# Altium project Soldier.PrjPcb (part 2 of 2)

## Sheet soldier_TIA.SchDoc
size Tabloid; SheetNumber: 3; SheetTotal: 6
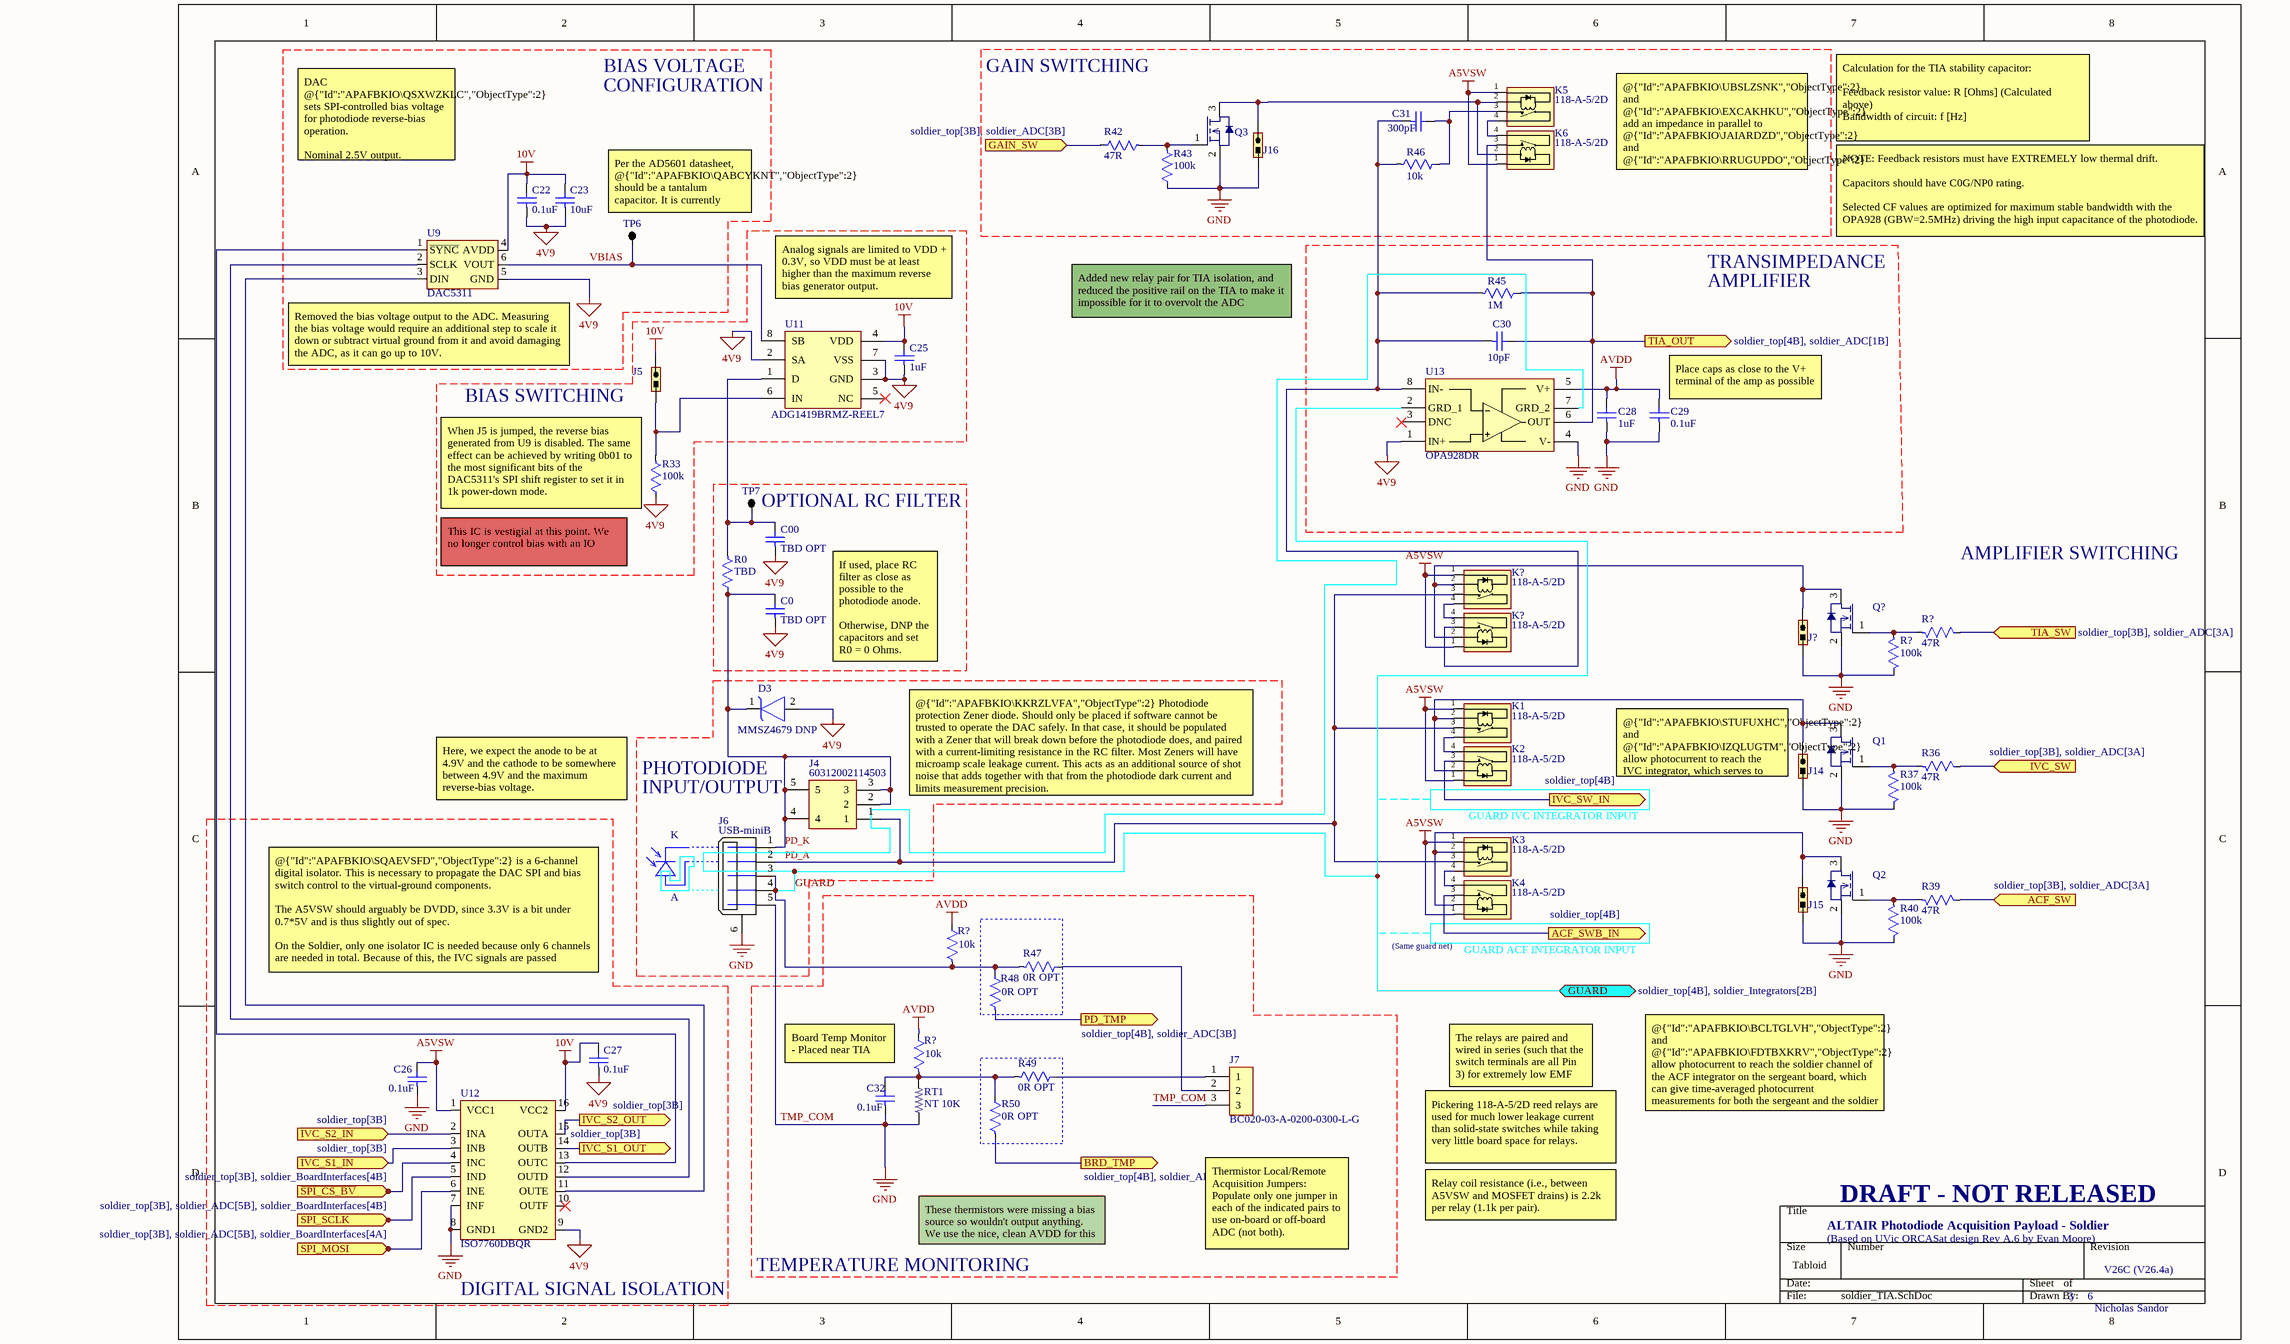
[diagram p3: soldier_TIA.SchDoc]

### Parts
C00  TBD OPT  [CAP 0603 IPC MID DENSITY]
C0  TBD OPT  [CAP 0603 IPC MID DENSITY]
C22  0.1uF  [CAP 0603 IPC MID DENSITY]
C23  10uF  [CAP 1206 IPC LOW DENSITY]
C25  1uF  [CAP 0603 IPC MID DENSITY]
C26  0.1uF  [CAP 0603 IPC MID DENSITY]
C27  0.1uF  [CAP 0603 IPC MID DENSITY]
C28  1uF  [CAP 0603 IPC MID DENSITY]
C29  0.1uF  [CAP 0603 IPC MID DENSITY]
C30  10pF  [CAP 1206 UNKNOWN]
C31  300pF  [CAP 1206 NON-IPC KEMET NP0]
C32  0.1uF  [CAP 0603 IPC MID DENSITY]
D3  MMSZ4679 DNP  [SOD-123 ONSEMI SMALL PADS]
J4  60312002114503  [COAX SMA THT]
J5  Jumper  [JUMPER 2POS 2.54MM PITCH THT]  (value not drawn)
J6  USB-miniB  [USB-miniB]
J7  BC020-03-A-0200-0300-L-G  [JUMPER 3POS 1MM PITCH THT]
J14  Jumper  [JUMPER 2POS 2.54MM PITCH THT]  (value not drawn)
J15  Jumper  [JUMPER 2POS 2.54MM PITCH THT]  (value not drawn)
J16  Jumper  [JUMPER 2POS 2.54MM PITCH THT]  (value not drawn)
J19  Jumper  [JUMPER 2POS 2.54MM PITCH THT]  (value not drawn)
K1  118-A-5/2D  [118-A-5/2D]
K2  118-A-5/2D  [118-A-5/2D]
K3  118-A-5/2D  [118-A-5/2D]
K4  118-A-5/2D  [118-A-5/2D]
K5  118-A-5/2D  [118-A-5/2D]
K6  118-A-5/2D  [118-A-5/2D]
K7  118-A-5/2D  [118-A-5/2D]
K8  118-A-5/2D  [118-A-5/2D]
Q1  DMG2302UK  [SOT90-3 LOW DENSITY]  (value not drawn)
Q2  DMG2302UK  [SOT90-3 LOW DENSITY]  (value not drawn)
Q3  DMG2302UK  [SOT90-3 LOW DENSITY]  (value not drawn)
Q4  DMG2302UK  [SOT90-3 LOW DENSITY]  (value not drawn)
R0  TBD  [RES 0402 IPC MID DENSITY]
R19  47R  [RES 0603 IPC MID DENSITY]
R20  100k  [RES 0603 IPC MID DENSITY]
R33  100k  [RES 0603 IPC MID DENSITY]
R34  10k  [RES 0603 IPC MID DENSITY]
R35  10k  [RES 0603 IPC MID DENSITY]
R36  47R  [RES 0603 IPC MID DENSITY]
R37  100k  [RES 0603 IPC MID DENSITY]
R39  47R  [RES 0603 IPC MID DENSITY]
R40  100k  [RES 0603 IPC MID DENSITY]
R42  47R  [RES 0603 IPC MID DENSITY]
R43  100k  [RES 0603 IPC MID DENSITY]
R45  1M  [RES 1206 IPC MID DENSITY]
R46  10k  [RES 1206 IPC MID DENSITY]
R47  0R OPT  [RES 0603 IPC MID DENSITY]
R48  0R OPT  [RES 0603 IPC MID DENSITY]
R49  0R OPT  [RES 0603 IPC MID DENSITY]
R50  0R OPT  [RES 0603 IPC MID DENSITY]
RT1  value NT 10K  [RES 0603 IPC MID DENSITY]  (hidden comment: NTC 0603 10K 1%)
TP6  Testpoint  [TESTPOINT THT]  (value not drawn)  (no BOM)
TP7  Testpoint  [TESTPOINT THT]  (value not drawn)  (no BOM)
U9  DAC5311  [SOT363-6 MID DENSITY]
U11  ADG1419BRMZ-REEL7  [8-TSOP 0.65MM PITCH 3MM WIDTH IPC LOW DENSITY]
U12  ISO7760DBQR  [16-SSOP 0.635MM PITCH 5.4MM WIDTH NON-IPC TI]
U13  OPA928DR  [8-SOIC 4MM WIDE MID DENSITY]

### Blocks framed on the sheet
GAIN SWITCHING: C31 J16 K5 K6 Q3 R42 R43 R46
BIAS SWITCHING: C25 J5 R33 U11
OPTIONAL RC FILTER: C0 C00 R0 TP7
DIGITAL SIGNAL ISOLATION: C26 C27 U12
TEMPERATURE MONITORING: C32 J7 R34 R35 R47-R50 RT1

### Ports
ACF_SW (in, see soldier_top[3B], soldier_ADC[3A]), ACF_SWB_IN (out, see soldier_top[4B]), BRD_TMP (out, see soldier_top[4B], soldier_ADC[3B]), GAIN_SW (in, see soldier_top[3B], soldier_ADC[3B]), GUARD (bidir, see soldier_top[4B], soldier_Integrators[2B]), IVC_S1_IN (in, see soldier_top[3B]), IVC_S1_OUT (out, see soldier_top[3B]), IVC_S2_IN (in, see soldier_top[3B]), IVC_S2_OUT (out, see soldier_top[3B]), IVC_SW (in, see soldier_top[3B], soldier_ADC[3A]), IVC_SW_IN (out, see soldier_top[4B]), PD_TMP (out, see soldier_top[4B], soldier_ADC[3B]), SPI_MOSI (in, see soldier_top[3B], soldier_ADC[5B], soldier_BoardInterfaces[4A]), SPI_SCLK (in, see soldier_top[3B], soldier_ADC[5B], soldier_BoardInterfaces[4B]), TIA_OUT (out, see soldier_top[4B], soldier_ADC[1B]), TIA_SW (in, see soldier_top[3B], soldier_ADC[3A]), ~{SPI_CS_BV} (in, see soldier_top[3B], soldier_BoardInterfaces[4B])

### Nets
4V9: C00.1 C0.1 C22.1 C23.1 C25.1 C27.1 D3.2(Anode) R33.2 U9.5(GND) U11.2(SA) U11.3(GND) U11.7(VSS) U12.9(GND2) U13.1(IN+)
10V: C22.2 C23.2 C25.2 C27.2 J5.2 U9.4(AVDD) U11.4(VDD) U12.16(VCC2)
A5VSW: C26.2 K1.1 K2.1 K3.1 K4.1 K5.1 K6.1 K7.1 K8.1 U12.1(VCC1)
AVDD: C28.2 C29.2 R34.2 R35.2 U13.5(V+)
GND: C26.1 C28.1 C29.1 C32.1 J6.5 J6.6(SHLD) J7.3 J14.1 J15.1 J16.1 J19.1 Q1.2(Source) Q2.2(Source) Q3.2(Source) Q4.2(Source) R20.2 R37.2 R40.2 R43.2 RT1.1 U12.7(INF) U12.8(GND1) U13.4(V-)  [also labelled TMP_COM]  [project net SYS_GND]
GUARD: J6.3 J6.4 R34.1 R47.1 R48.2 U13.2(GRD_1) U13.7(GRD_2) ; port GUARD
IVC_SW_1_Sol: U12.3(INB) ; port IVC_S1_IN
IVC_SW_2_Sol: U12.2(INA) ; port IVC_S2_IN
PD_A: J4.1 J6.2 K1.3 K3.3 K7.3
PD_K: C0.2 D3.1(Cathode) J4.2 J4.3 J4.4 J4.5 J6.1 R0.2
VBIAS: TP6.1 U9.6(VOUT) U11.8(SB)
NetC00_2: C00.2 R0.1 TP7.1 U11.1(D)
NetC30_1: C30.1 C31.1 K8.3 R45.1 R46.1 U13.8(IN-)
NetC30_2: C30.2 K6.3 R45.2 U13.6(OUT) ; port TIA_OUT
NetC31_2: C31.2 K5.3 R46.2
NetC32_2: C32.2 R35.1 R49.1 R50.2 RT1.2
NetJ5_1: J5.1 R33.1 U11.6(IN)
NetJ7_1: J7.1 R49.2
NetJ7_2: J7.2 R47.2
NetJ9_1: K4.3 ; port ACF_SWB_IN
NetJ14_2: J14.2 K1.2 K2.2 Q1.3(Drain)
NetJ15_2: J15.2 K3.2 K4.2 Q2.3(Drain)
NetJ16_2: J16.2 K5.2 K6.2 Q3.3(Drain)
NetJ19_2: J19.2 K7.2 K8.2 Q4.3(Drain)
NetK1_4: K1.4 K2.4
NetK2_3: K2.3 ; port IVC_SW_IN
NetK3_4: K3.4 K4.4
NetK5_4: K5.4 K6.4
NetK7_4: K7.4 K8.4
NetQ1_1: Q1.1(Gate) R36.1 R37.1
NetQ2_1: Q2.1(Gate) R39.1 R40.1
NetQ3_1: Q3.1(Gate) R42.1 R43.1
NetQ4_1: Q4.1(Gate) R19.1 R20.1
NetR5_2: U12.6(INE) ; port SPI_MOSI
NetR9_2: U12.4(INC) ; port ~{SPI_CS_BV}
NetR11_2: U12.5(IND) ; port SPI_SCLK
NetR19_2: R19.2 ; port TIA_SW
NetR36_2: R36.2 ; port IVC_SW
NetR39_2: R39.2 ; port ACF_SW
NetR42_2: R42.2 ; port GAIN_SW
NetR48_1: R48.1 ; port PD_TMP
NetR50_1: R50.1 ; port BRD_TMP
NetU9_1: U9.1(~{SYNC}) U12.13(OUTC)
NetU9_2: U9.2(SCLK) U12.12(OUTD)
NetU9_3: U9.3(DIN) U12.11(OUTE)
NetU12_14: U12.14(OUTB) ; port IVC_S1_OUT
NetU12_15: U12.15(OUTA) ; port IVC_S2_OUT

Not connected (* = marked no-connect by the designer): U11 5(NC)*; U12 10(OUTF)*; U13 3(DNC)*

### Notes on the sheet
- BIAS VOLTAGE
- CONFIGURATION
- Calculation for the TIA stability capacitor:
  Feedback resistor value: R [Ohms] (Calculated above)
  Bandwidth of circuit: f [Hz]
  C = 1/(2pi R f) [F]
- DAC @{"Id":"APAFBKIO\QSXWZKLC","ObjectType":2} sets SPI-controlled bias voltage for photodiode reverse-bias operation.
  Nominal 2.5V output.
- Per the AD5601 datasheet, @{"Id":"APAFBKIO\QABCYKNT","ObjectType":2} should be a tantalum capacitor. It is currently specified as an MLCC.
- @{"Id":"APAFBKIO\UBSLZSNK","ObjectType":2} and @{"Id":"APAFBKIO\EXCAKHKU","ObjectType":2} add an impedance in parallel to @{"Id":"APAFBKIO\JAIARDZD","ObjectType":2} and @{"Id":"APAFBKIO\RRUGUPDO","ObjectType":2} to lower the gain of the TIA, which measures the photocurrent in the case where the laser is not being pulsed.
- TRANSIMPEDANCE
- NOTE: Feedback resistors must have EXTREMELY low thermal drift.
  Capacitors should have C0G/NP0 rating.
  Selected CF values are optimized for maximum stable bandwidth with the OPA928 (GBW=2.5MHz) driving the high input capacitance of the photodiode.
- Analog signals are limited to VDD + 0.3V, so VDD must be at least higher than the maximum reverse bias generator output.
- Added new relay pair for TIA isolation, and reduced the positive rail on the TIA to make it impossible for it to overvolt the ADC
- AMPLIFIER
- (near U9) Removed the bias voltage output to the ADC. Measuring the bias voltage would require an additional step to scale it down or subtract virtual ground from it and avoid damaging the ADC, as it can go up to 10V.
- (near C29) Place caps as close to the V+ terminal of the amp as possible
- (near R33) When J5 is jumped, the reverse bias generated from U9 is disabled. The same effect can be achieved by writing 0b01 to the most significant bits of the DAC5311's SPI shift register to set it in 1k power-down mode.
- (near R33) This IC is vestigial at this point. We no longer control bias with an IO
- AMPLIFIER SWITCHING
- If used, place RC filter as close as possible to the photodiode anode.
  Otherwise, DNP the capacitors and set R0 = 0 Ohms.
- Here, we expect the anode to be at 4.9V and the cathode to be somewhere between 4.9V and the maximum reverse-bias voltage.
- PHOTODIODE
- INPUT/OUTPUT
- @{"Id":"APAFBKIO\KKRZLVFA","ObjectType":2} Photodiode protection Zener diode. Should only be placed if software cannot be trusted to operate the DAC safely. In that case, it should be populated with a Zener that will break down before the photodiode does, and paired with a current-limiting resistance in the RC filter. Most Zeners will have microamp scale leakage current. This acts as an additional source of shot noise that adds together with that from the photodiode dark current and limits measurement precision.
- GUARD IVC INTEGRATOR INPUT
- (near J14) @{"Id":"APAFBKIO\STUFUXHC","ObjectType":2} and @{"Id":"APAFBKIO\IZQLUGTM","ObjectType":2} allow photocurrent to reach the IVC integrator, which serves to validate the value read from the soldier channel of the ACF.
- K
- A
- @{"Id":"APAFBKIO\SQAEVSFD","ObjectType":2} is a 6-channel digital isolator. This is necessary to propagate the DAC SPI and bias switch control to the virtual-ground components.
  The A5VSW should arguably be DVDD, since 3.3V is a bit under 0.7*5V and is thus slightly out of spec.
  On the Soldier, only one isolator IC is needed because only 6 channels are needed in total. Because of this, the IVC signals are passed through the 2 remaining channels on this isolator.
- (near K4) (Same guard net)
- (near K4) GUARD ACF INTEGRATOR INPUT
- Board Temp Monitor
  - Placed near TIA
- The relays are paired and wired in series (such that the switch terminals are all Pin 3) for extremely low EMF
- @{"Id":"APAFBKIO\BCLTGLVH","ObjectType":2} and @{"Id":"APAFBKIO\FDTBXKRV","ObjectType":2} allow photocurrent to reach the soldier channel of the ACF integrator on the sergeant board, which can give time-averaged photocurrent measurements for both the sergeant and the soldier photodiodes with nearly identical characteristics between the two.
- Pickering 118-A-5/2D reed relays are used for much lower leakage current than solid-state switches while taking very little board space for relays.
- These thermistors were missing a bias source so wouldn't output anything. We use the nice, clean AVDD for this now.
- Relay coil resistance (i.e., between A5VSW and MOSFET drains) is 2.2k per relay (1.1k per pair).
- ALTAIR Photodiode Acquisition Payload - Soldier
- (Based on UVic ORCASat design Rev A.6 by Evan Moore)
- DRAFT - NOT RELEASED
- Thermistor Local/Remote Acquisition Jumpers:
  Populate only one jumper in each of the indicated pairs to use on-board or off-board ADC (not both).

### Library data of the parts
C00 C0 = CAP: Murata GRT188R61H105KE13D - Cap Ceramic 1uF 10% 50V X5R 0603 (Placeholder); MF: Murata; MP: GRT188R61H105KE13D
C22 C26 C27 C29 C32 = CAP: as C5 on sheet soldier_Power; MF: Kemet; MP: C0603C104K5RACAUTO
  C26 C27: Parameter 1: *; Parameter 2: *
C23 = CAP: Murata GRT319R6YA106KE01D - Cap Ceramic 10uF 35V X5R 10% Pad SMD 1206 85C Automotive T/R; MF: Murata; MP: GRT319R6YA106KE01D
C25 C28 = CAP: Murata GRT188R61H105KE13D - Cap MLCC AEEC-Q200 X5R 1uF 50V 0603; MF: Murata; MP: GRT188R61H105KE13D
C30 = CAP: Wurth Elektronik 885012008037 - Cap Ceramic 10pF 5% 50V NP0 1206; MF: Wurth Elektronik; MP: 885012008037
C31 = CAP: Kemet C1206C301K5GACTU - Cap Ceramic 300pF 10% 50V NP0 1206; MF: Kemet; MP: C1206C301K5GACTU
D3 = Zener: DIODE ZENER SOD123; MF: onsemi; MP: MMSZ4679T1G
J4 = 60312002114503: Coaxial, SMA Female Jack, 50 Ohm, Through-Hole; MF: Wurth Elektronik; Datasheet Link: https://katalog.we-online.de/em/datasheet/60312002114503.pdf; Height: 9.56mm; MP: 60312002114503; Mouser Part Number: 710-60312002114503; Mouser Price/Stock: https://www.mouser.co.uk/ProductDetail/Wurth-Elektronik/60312002114503?qs=3jNSNtuqJTL%2FGpZA1FAOxw%3D%3D
J5 J14-J16 J19 = Jumper 2POS: CONN HEADER VERT 2POS; MF: Samtec Inc.; MP: TSW-101-23-G-D; Supplier 1: Digi-Key; Supplier Part Number 1: SAM1068-01-ND; Operating Temperature: -55°C ~ 125°C
J6 = USB-miniB: Conn Mini-USB RCP 5 POS Solder ST Thru-Hole 5 Terminal 1 Port; Number of Positions: 5; Gender: Female; MF: Amphenol Commercial; MP: UE25BE5510H; RoHS: Yes; Category: USB Connectors; Stock 1: 6446; Mount: Through Hole; Color: Black; Contact Material: Copper Alloy; Contact Plating: Gold; Number of Contacts: 5; Termination: PCB; Features: High Temperature; Lead Free: Lead Free; Flammability Rating: UL94 V-0; ComponentLink1URL: http://components.arrow.com/part/dataview/0323_00956300?src-supplier=Arrow+Europe; ComponentLink1Description: http://components.arrow.com/part/dataview/0323_00956300?src-supplier=Arrow+Europe; ComponentLink2URL: http://www.alliedelec.com/m/d/e7e3d7a920045eebbdef787e60d8b001.pdf?src-supplier=Allied+Electronics; ComponentLink2Description: http://www.alliedelec.com/m/d/e7e3d7a920045eebbdef787e60d8b001.pdf?src-supplier=Allied+Electronics; ComponentLink3URL: https://www.amphenolcanada.com/ProductSearch/drawings/AC/UE25BEX510X.pdf?src-supplier=Digi-Key; ComponentLink3Description: https://www.amphenolcanada.com/ProductSearch/drawings/AC/UE25BEX510X.pdf?src-supplier=Digi-Key; Supplier 1: Digi-Key; Supplier Part Number 1: UE25BE5510H-ND
J7 = BC020-03-A-0200-0300-L-G: 3x1 Header SMD; MF: GCT (GLOBAL CONNECTOR TECHNOLOGY); Datasheet Link: https://www.mouser.com/datasheet/2/837/BC020-1948594.pdf; Height: 3.2mm; MP: BC020-03-A-0200-0300-L-G
K1-K8 = RELAY 118-A-5/2D: High coil resistance SIL/SIP Reed Relay 118-A-5/2D; MF: Pickering; MP: 118-1-A-5/2D
Q1-Q4 = NMOS DMG2302UK: DIODES INC. Power MOSFET, N Channel, 20 V, 2.8 A, 0.061 ohm, SOT-23, Surface Mount; MP: DMG2302UK-7; ComponentLink1URL: http://www.farnell.com/datasheets/2814387.pdf?src-supplier=Farnell; ComponentLink1Description: http://www.farnell.com/datasheets/2814387.pdf?src-supplier=Farnell; ComponentLink2URL: http://www.farnell.com/datasheets/2814387.pdf?src-supplier=Element14; ComponentLink2Description: http://www.farnell.com/datasheets/2814387.pdf?src-supplier=Element14; ComponentLink3URL: https://www.diodes.com/assets/Datasheets/DMG2302UK.pdf?src-supplier=Digi-Key; ComponentLink3Description: https://www.diodes.com/assets/Datasheets/DMG2302UK.pdf?src-supplier=Digi-Key; ComponentLink4URL: http://www.farnell.com/datasheets/2814387.pdf?src-supplier=Newark; ComponentLink4Description: http://www.farnell.com/datasheets/2814387.pdf?src-supplier=Newark; Supplier 1: Digi-Key; Supplier Part Number 1: DMG2302UK-7DICT-ND; MF: Diodes
R0 = RES: as R3 on sheet soldier_BoardInterfaces; MF: YAGEO; MP: RC0402JR-070RL
R19 R36 R39 R42 = RES: Vishay CRCW060347R0JNEA - Res 47Ohm 5% 1/8W SMD 0603; MF: Vishay Dale
R20 R33 R37 R40 R43 = RES: Panasonic ERJ-3GEYJ104V - Res 100k 5% 1/10W SMD 0603; MF: Panasonic Electronic Components
R34 R35 = RES
R45 = RES: Vishay TNPV12061M00BYEN - Res 1MOhm 0.1% 1/4W SMD 1206; MF: Vishay Dale; MP: TNPV12061M00BYEN
R46 = RES: Stackpole RNCF1206TKY10K0 - Res 10k 0.01% 1/4W SMD 1206; MF: Stackpole Electronics Inc.; MP: RNCF1206TKY10K0
R47-R50 = RES: Vishay CRCW06030000Z0EA - Res 0 Ohms 1/8W SMD 0603; MF: Vishay Dale; MP: CRCW06030000Z0EA
RT1 = THERM_RES NTC 0603 10K 1%: THERMISTOR NTC 10KOHM 3380K 0603; MF: Murata; MP: NCU18XH103F60RB; RoHS: No; Category: Thermistors; Stock 1: 48580; Case/Package: 0603; Case Code (Metric): 1608; Case Code (Imperial): 0603; Min Operating Temperature: -40°C; Max Operating Temperature: 125°C; REACH SVHC: No SVHC; ComponentLink1URL: http://www.farnell.com/datasheets/2095755.pdf?src-supplier=Farnell; ComponentLink1Description: http://www.farnell.com/datasheets/2095755.pdf?src-supplier=Farnell; ComponentLink2URL: https://www.murata.com/en-us/products/productdata/8796836233246/L0770E.pdf?src-supplier=Digi-Key; ComponentLink2Description: https://www.murata.com/en-us/products/productdata/8796836233246/L0770E.pdf?src-supplier=Digi-Key; ComponentLink3URL: http://www.farnell.com/datasheets/2095755.pdf?src-supplier=Element14; ComponentLink3Description: http://www.farnell.com/datasheets/2095755.pdf?src-supplier=Element14; Supplier 1: Digi-Key; Supplier Part Number 1: 490-16279-1-ND
U9 = DAC5311: DAC 8bit 1 channel SPI Supply Reference Buffered Voltage; MF: Texas Instruments; MP: DAC5311IDCKR
U11 = ADG1419BRMZ-REEL7: Analog Switch Single SPDT 8-Pin MSOP T/R; MF: Analog Devices; Number of Inputs: 1; Number of Outputs: 2; Min Supply Voltage: 5V; Operating Supply Voltage: 12V; Max Supply Voltage: 16.5V; Min Dual Supply Voltage: 4.5V; Max Power Dissipation: 2mW; On-State Resistance: 2.4R; Turn-On Delay Time: 110ns; Turn-Off Delay Time: 140ns; Max Supply Current: 95uA; -3db Bandwidth: 135MHz; Supply Type: Single,Dual; Dual Supply Voltage: 15V; Polarity: Non-Inverting; Interface: Parallel; Test Frequency: 1MHz; Insertion Loss: 0.16dB; Supplier 1: Digi-Key; MP: ADG1419BRMZ-REEL7; RoHS: Yes; Category: Decoders and Multiplexers; Stock 1: 12144; Pricing 1: 1=4.40000, 10=3.95100, 25=3.73520, 100=3.07100, 250=2.75560, 500=2.65600 (USD); Case/Package: MSOP; Number of Pins: 8; Contact Plating: Tin,Matte; Min Operating Temperature: -40°C; Max Operating Temperature: 125°C; Number of Channels: 1; Max Dual Supply Voltage: 16.5V; Package Quantity: 1000; Packaging: Tape and Reel; Number of Circuits: 1; Throw Configuration: SPDT; Power Dissipation: 2mW; Bandwidth: 135MHz; Radiation Hardening: No; Lead Free: Contains Lead; ComponentLink1URL: https://datasheet.ciiva.com/15127/getdatasheetpartid-348881-15127783.pdf?src-supplier=Verical; ComponentLink1Description: https://datasheet.ciiva.com/15127/getdatasheetpartid-348881-15127783.pdf?src-supplier=Verical; ComponentLink2URL: https://datasheet.ciiva.com/14846/adg1419-14846917.pdf?src-supplier=Digi-Key; ComponentLink2Description: https://datasheet.ciiva.com/14846/adg1419-14846917.pdf?src-supplier=Digi-Key; ComponentLink3URL: https://datasheet.ciiva.com/14846/adg1419-14846919.pdf?src-supplier=Digi-Key; ComponentLink3Description: https://datasheet.ciiva.com/14846/adg1419-14846919.pdf?src-supplier=Digi-Key; ComponentLink4URL: https://datasheet.ciiva.com/16637/adg1419-16637818.pdf?src-supplier=Avnet+Europe; ComponentLink4Description: https://datasheet.ciiva.com/16637/adg1419-16637818.pdf?src-supplier=Avnet+Europe; ComponentLink5URL: https://datasheet.ciiva.com/2980/adg1419-2980845.pdf?src-supplier=Avnet; ComponentLink5Description: https://datasheet.ciiva.com/2980/adg1419-2980845.pdf?src-supplier=Avnet; ComponentLink6URL: https://datasheet.ciiva.com/48708/001247710-da-01-en-ic-switch-2-adg1419brmz-reel7-msop-8-adi-48708556.pdf?src-supplier=Conrad; ComponentLink6Description: https://datasheet.ciiva.com/48708/001247710-da-01-en-ic-switch-2-adg1419brmz-reel7-msop-8-adi-48708556.pdf?src-supplier=Conrad; Supplier Part Number 1: ADG1419BRMZ-REEL7CT-ND
U12 = ISO7760DBQR: Digital Isolator 6-Channel 6/0 Inputs 16SSOP; MF: Texas Instruments; MP: ISO7760DBQR
U13 = OPA928DR: Op Amp, 36V, fA input, precision, e-trim; MF: Texas Instruments; Datasheet Link: https://www.ti.com/lit/ds/symlink/opa928.pdf?HQS=dis-mous-null-mousermode-dsf-pf-null-wwe&ts=1731036524091&ref_url=https%253A%252F%252Fwww.ti.com%252Fgeneral%252Fdocs%252Fsuppproductinfo.tsp%253FdistId%253D26%2526gotoUrl%253Dhttps%253A%252F%252Fwww.ti.com; Height: 1.75mm; MP: OPA928DR; Mouser Part Number: 595-OPA928DR; Mouser Price/Stock: https://www.mouser.co.uk/ProductDetail/Texas-Instruments/OPA928DR?qs=2wMNvWM5ZX5RgAZJHoeYSw%3D%3D; Arrow Part Number: OPA928DR; Arrow Price/Stock: null?region=nac

## Sheet soldier_Integrators.SchDoc
size Tabloid; SheetNumber: 5; SheetTotal: 6
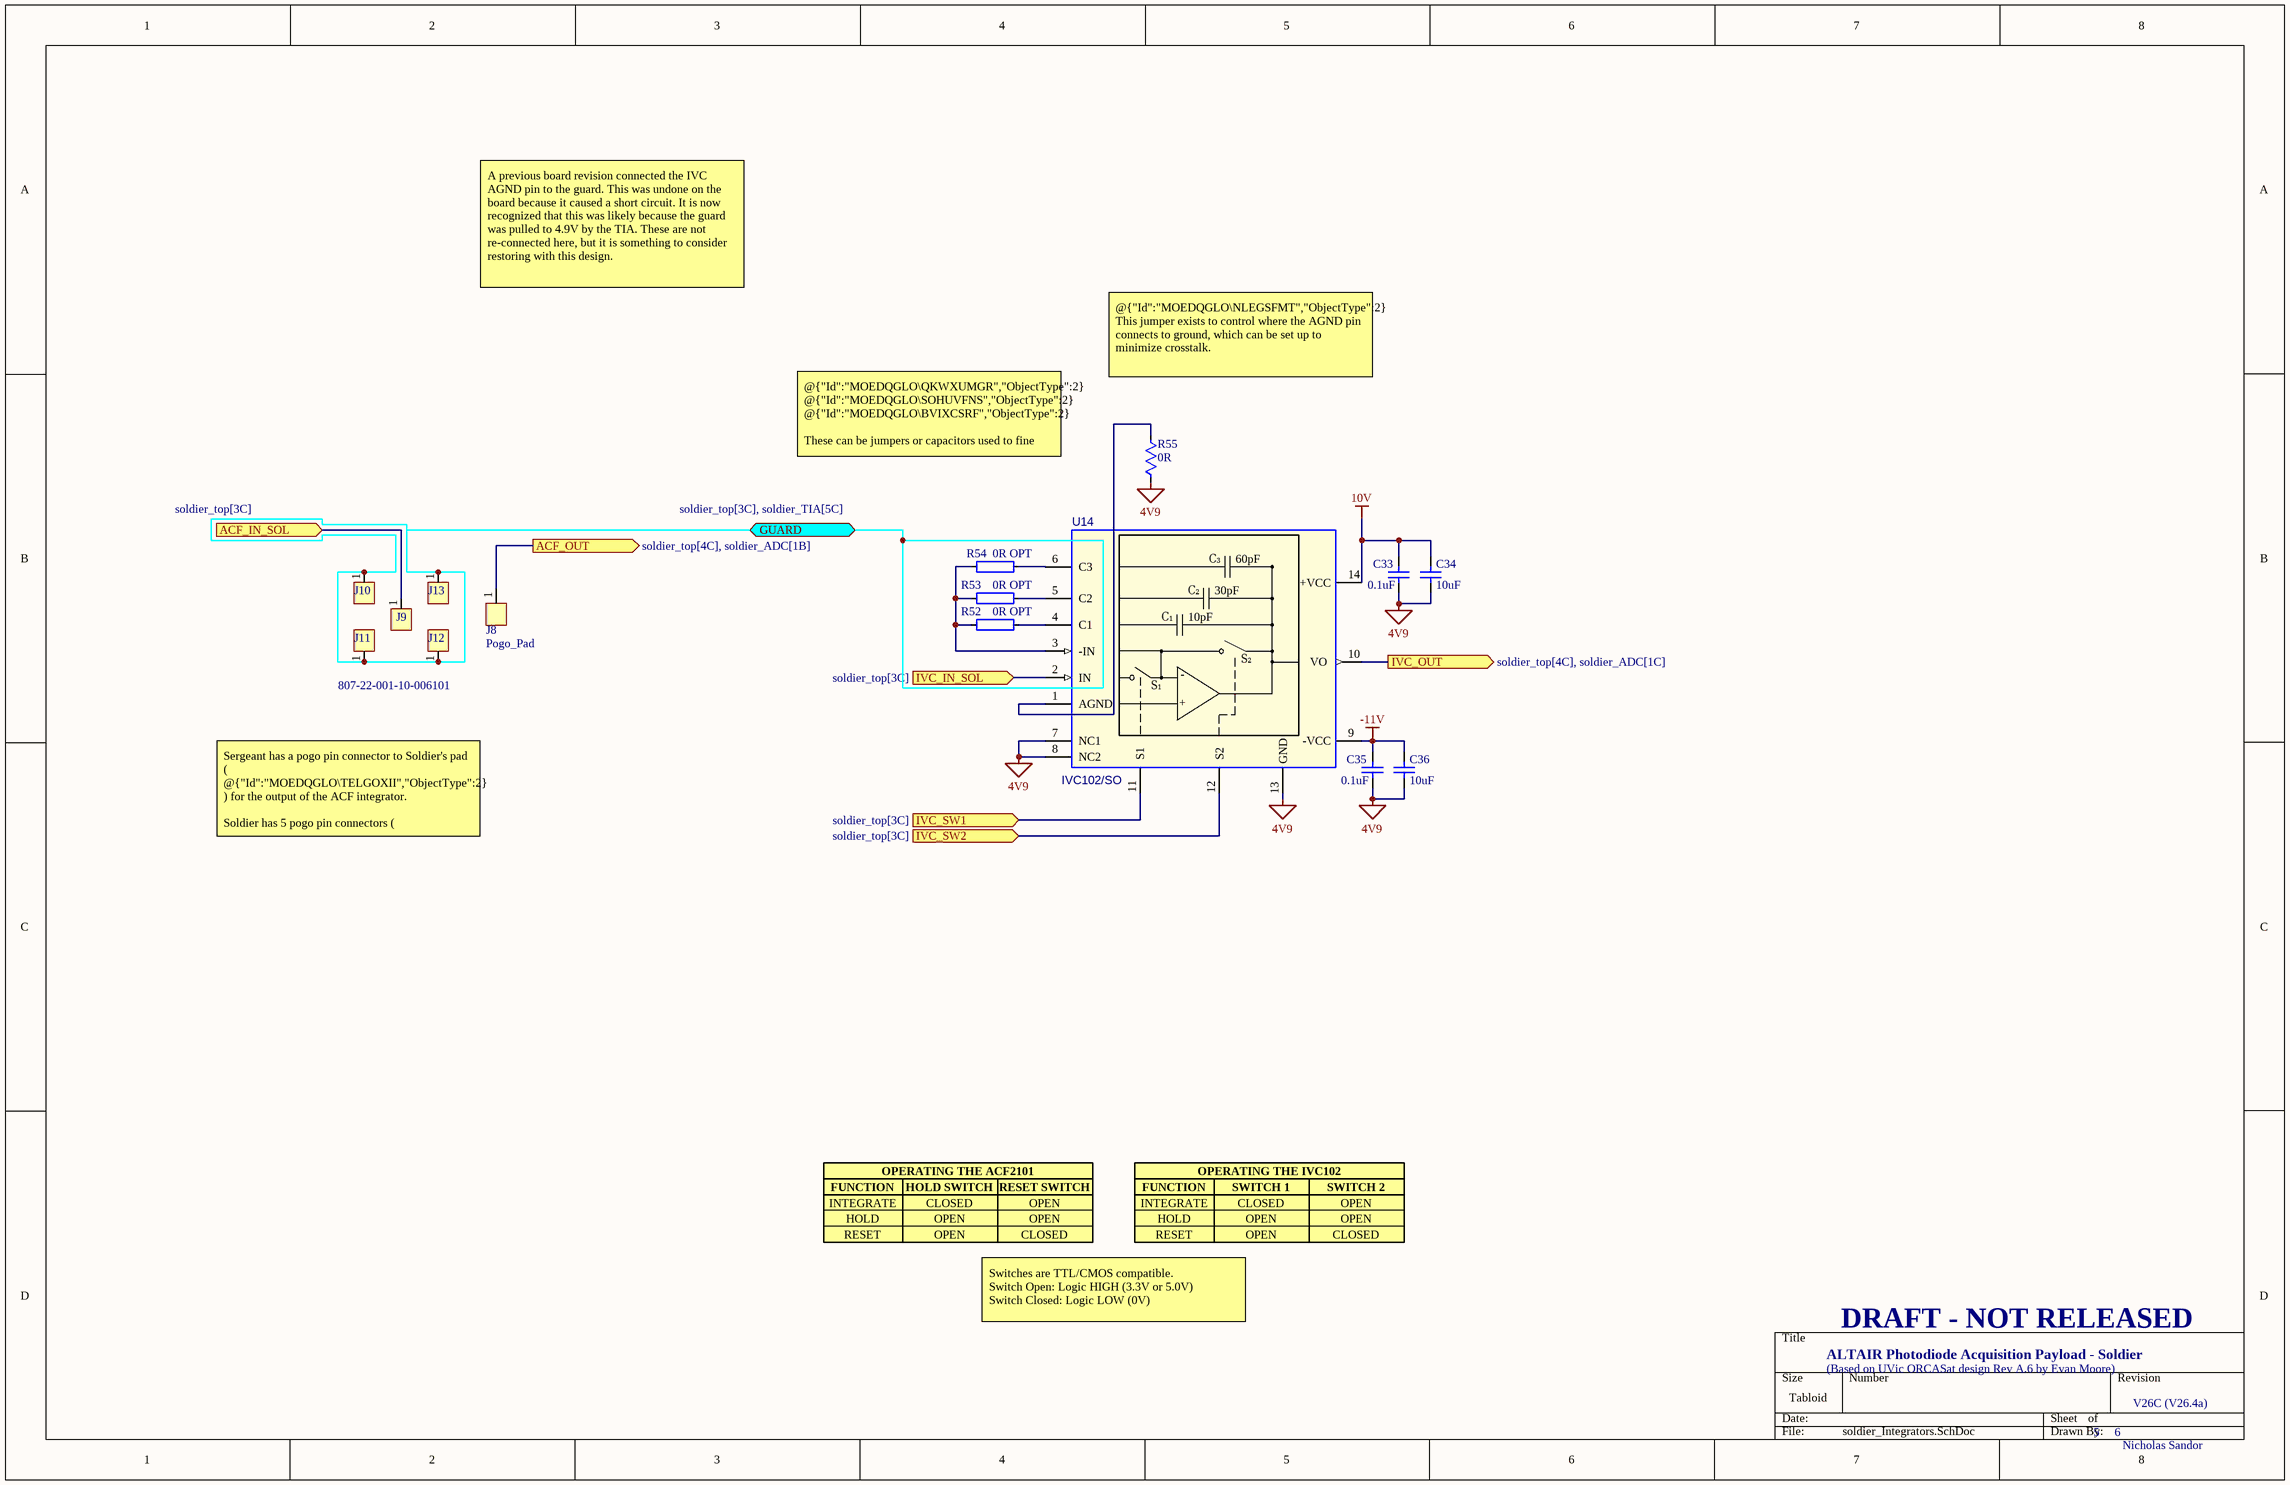
[diagram p4: soldier_Integrators.SchDoc]

### Parts
C33  0.1uF  [CAP 0603 NON-IPC KEMET X7R]
C34  10uF  [CAP 0805 IPC MID DENSITY]
C35  0.1uF  [CAP 0603 NON-IPC KEMET X7R]
C36  10uF  [CAP 0805 IPC MID DENSITY]
J8  Pogo_Pad  [POGO PAD SOLDIER]  (no BOM)
J9  807-22-001-10-006101  [POGO PIN 807-22-001-10-006101]
J10  807-22-001-10-006101  [POGO PIN 807-22-001-10-006101]  (value not drawn)
J11  807-22-001-10-006101  [POGO PIN 807-22-001-10-006101]  (value not drawn)
J12  807-22-001-10-006101  [POGO PIN 807-22-001-10-006101]  (value not drawn)
J13  807-22-001-10-006101  [POGO PIN 807-22-001-10-006101]  (value not drawn)
R52  0R OPT  [RES 0402 IPC LOW DENSITY]
R53  0R OPT  [RES 0402 IPC LOW DENSITY]
R54  0R OPT  [RES 0402 IPC LOW DENSITY]
R55  0R  [RES 0402 IPC MID DENSITY]
U14  IVC102/SO  [14-SOIC 4MM WIDE LOW DENSITY]

### Ports
ACF_IN_SOL (in, see soldier_top[3C]), ACF_OUT (out, see soldier_top[4C], soldier_ADC[1B]), GUARD (bidir, see soldier_top[3C], soldier_TIA[5C]), IVC_IN_SOL (in, see soldier_top[3C]), IVC_OUT (out, see soldier_top[4C], soldier_ADC[1C]), IVC_SW1 (in, see soldier_top[3C]), IVC_SW2 (in, see soldier_top[3C])

### Nets
4V9: C33.1 C34.1 C35.1 C36.1 R55.2 U14.7(NC1) U14.8(NC2) U14.13(GND)
10V: C33.2 C34.2 U14.14(+VCC)
-11V: C35.2 C36.2 U14.9(-VCC)
GUARD: J10.1 J11.1 J12.1 J13.1 ; port GUARD
NetJ8_1: J8.1 ; port ACF_OUT
NetJ9_1: J9.1 ; port ACF_IN_SOL
NetK2_3: U14.2(IN) ; port IVC_IN_SOL
NetR52_1: R52.1 R53.1 R54.1 U14.3(-IN)
NetR52_2: R52.2 U14.4(C1)
NetR53_2: R53.2 U14.5(C2)
NetR54_2: R54.2 U14.6(C3)
NetR55_1: R55.1 U14.1(AGND)
NetU12_14: U14.11(S1) ; port IVC_SW1
NetU12_15: U14.12(S2) ; port IVC_SW2
NetU14_10: U14.10(VO) ; port IVC_OUT

### Notes on the sheet
- A previous board revision connected the IVC AGND pin to the guard. This was undone on the board because it caused a short circuit. It is now recognized that this was likely because the guard was pulled to 4.9V by the TIA. These are not re-connected here, but it is something to consider restoring with this design.
- @{"Id":"MOEDQGLO\NLEGSFMT","ObjectType":2}
  This jumper exists to control where the AGND pin connects to ground, which can be set up to minimize crosstalk.
- @{"Id":"MOEDQGLO\QKWXUMGR","ObjectType":2} @{"Id":"MOEDQGLO\SOHUVFNS","ObjectType":2} @{"Id":"MOEDQGLO\BVIXCSRF","ObjectType":2}
  These can be jumpers or capacitors used to fine tune the IVC's response. At least one must be populated to close the op-amp feedback loop.
- Sergeant has a pogo pin connector to Soldier's pad ( @{"Id":"MOEDQGLO\TELGOXII","ObjectType":2} ) for the output of the ACF integrator.
  Soldier has 5 pogo pin connectors ( @{"Id":"MOEDQGLO\XDCRJTAV","ObjectType":2} @{"Id":"MOEDQGLO\LCOTXSJK","ObjectType":2} @{"Id":"MOEDQGLO\DWRKQWNA","ObjectType":2} ) arranged as a (signal pin surrounded by 4 guard pins) to Sergeant's pads for the input and guard on its side of the ACF integrator.
- FUNCTION
- INTEGRATE
- HOLD
- RESET
- OPERATING THE ACF2101
- HOLD SWITCH
- CLOSED
- OPEN
- RESET SWITCH
- OPERATING THE IVC102
- SWITCH 1
- SWITCH 2
- Switches are TTL/CMOS compatible.
  Switch Open: Logic HIGH (3.3V or 5.0V)
  Switch Closed: Logic LOW (0V)
- ALTAIR Photodiode Acquisition Payload - Soldier
- (Based on UVic ORCASat design Rev A.6 by Evan Moore)
- DRAFT - NOT RELEASED
- (in symbol IVC102/SO_5) C₃; 60pF; C₂; 30pF; C₁; 10pF; S₂; -; S₁; +

### Library data of the parts
C33 C35 = CAP: as C5 on sheet soldier_Power; MF: Kemet; MP: C0603C104K5RACAUTO
C34 C36 = CAP: as C7 on sheet soldier_Power; MF: Murata; MP: GRM21BR61E106KA73L
J8 = Pogo_Pad_NoGuard: Pad for Pogo Pin without Guard
J9-J13 = 807-22-001-10-006101: Mill-Max Individual Insulated Pin 5.99mm Initial Height; MF: Mill-Max; MP: 807-22-001-10-006101
R52-R54 = IMPEDANCE: Yageo RC0402JR-070RL - Res 0 Ohms 1/16W SMD 0402; MF: YAGEO; MP: RC0402JR-070RL
R55 = RES: as R3 on sheet soldier_BoardInterfaces; MF: YAGEO; MP: RC0402JR-070RL
U14 = IVC102/SO_5: Precision Switched Integrator Transimpedance Amplifier; MF: Texas Instruments; MP: IVC102/SO

## Sheet soldier_ADC.SchDoc
size Tabloid; SheetNumber: 6; SheetTotal: 6
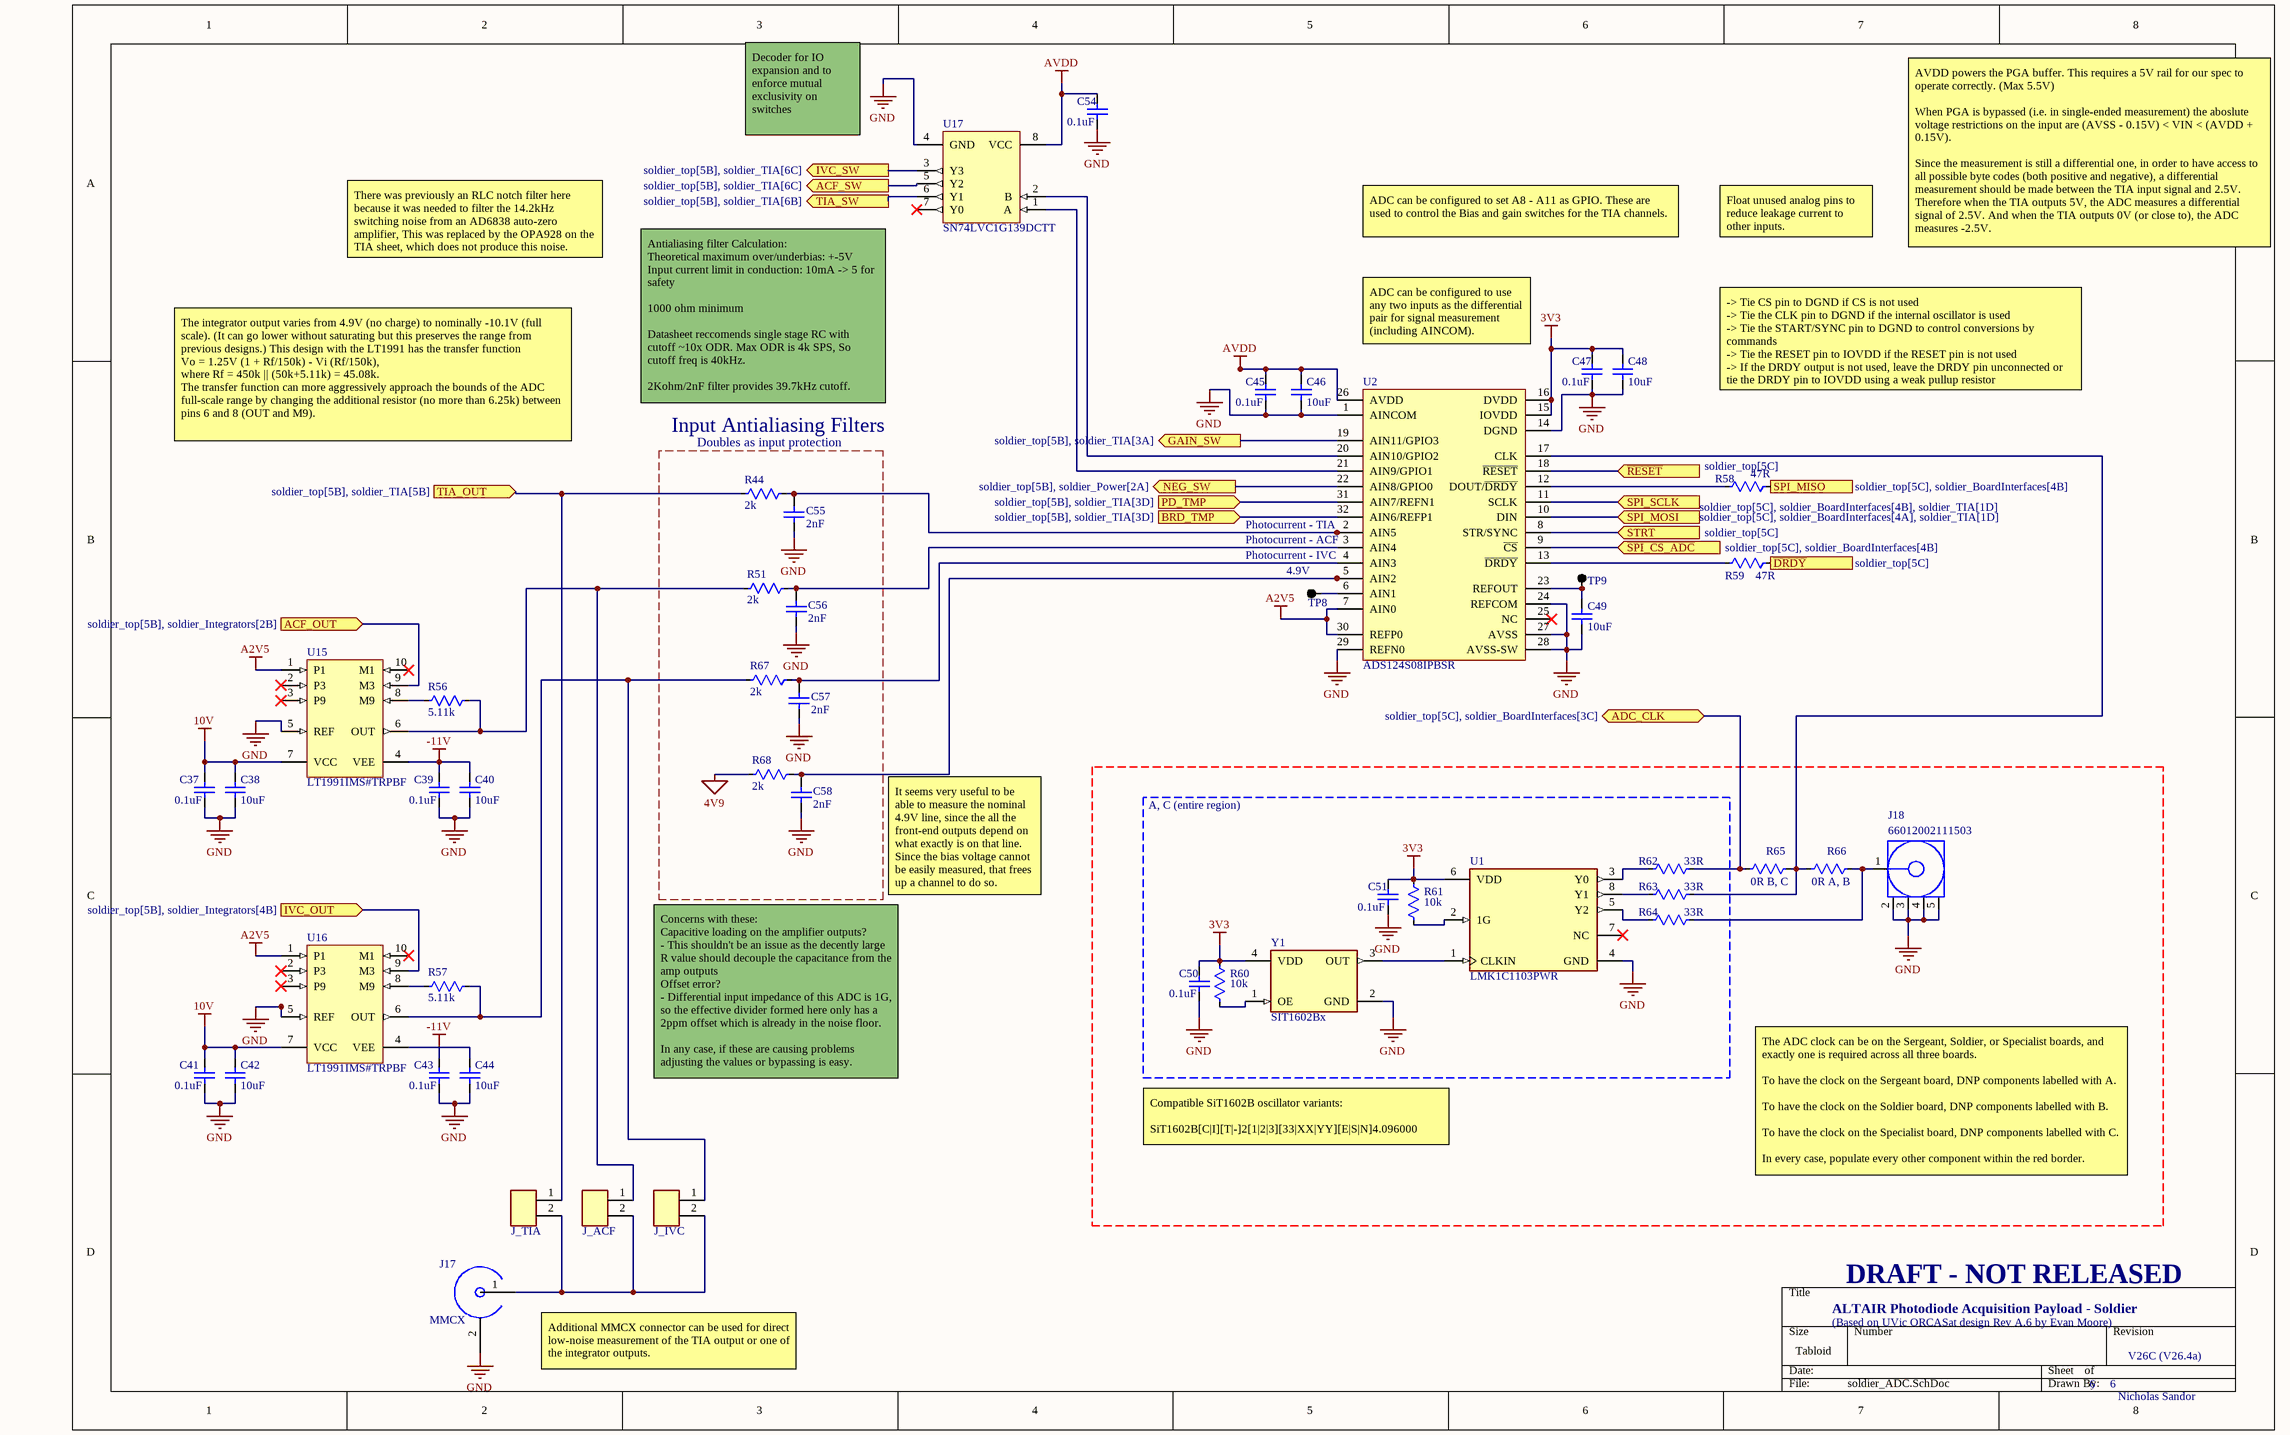
[diagram p5: soldier_ADC.SchDoc]

### Parts
C37  0.1uF  [CAP 0603 NON-IPC KEMET X7R]
C38  10uF  [CAP 0805 IPC MID DENSITY]
C39  0.1uF  [CAP 0603 NON-IPC KEMET X7R]
C40  10uF  [CAP 0805 IPC MID DENSITY]
C41  0.1uF  [CAP 0603 NON-IPC KEMET X7R]
C42  10uF  [CAP 0805 IPC MID DENSITY]
C43  0.1uF  [CAP 0603 NON-IPC KEMET X7R]
C44  10uF  [CAP 0805 IPC MID DENSITY]
C45  0.1uF  [CAP 0603 IPC MID DENSITY]
C46  10uF  [CAP 0805 IPC MID DENSITY]
C47  0.1uF  [CAP 0603 IPC MID DENSITY]
C48  10uF  [CAP 0805 IPC MID DENSITY]
C49  10uF  [CAP 0805 IPC MID DENSITY]
C50  0.1uF  [CAP 0603 IPC MID DENSITY]
C51  0.1uF  [CAP 0603 IPC MID DENSITY]
C54  0.1uF  [CAP 0603 IPC MID DENSITY]
C55  2nF  [CAP 1206 UNKNOWN]
C56  2nF  [CAP 1206 UNKNOWN]
C57  2nF  [CAP 1206 UNKNOWN]
C58  2nF  [CAP 1206 UNKNOWN]
J17  MMCX  [COAX MMCX SMD]
J18  66012002111503  [COAX MMCX THT]
J_ACF  J_ACF  [JUMPER 2POS 1MM PITCH THT]  (value not drawn)
J_IVC  J_IVC  [JUMPER 2POS 1MM PITCH THT]  (value not drawn)
J_TIA  J_TIA  [JUMPER 2POS 1MM PITCH THT]  (value not drawn)
R44  2k  [RES 0402 IPC MID DENSITY]
R51  2k  [RES 0402 IPC MID DENSITY]
R56  5.11k  [RES 0402 IPC MID DENSITY]
R57  5.11k  [RES 0402 IPC MID DENSITY]
R58  47R  [RES 0402 NON-IPC SEI]
R59  47R  [RES 0402 NON-IPC SEI]
R60  10k  [RES 0603 IPC MID DENSITY]
R61  10k  [RES 0603 IPC MID DENSITY]
R62  33R  [RES 0402 NON-IPC YAGEO]
R63  33R  [RES 0402 NON-IPC YAGEO]
R64  33R  [RES 0402 NON-IPC YAGEO]
R65  0R B, C  [RES 0402 IPC MID DENSITY]
R66  0R A, B  [RES 0402 IPC MID DENSITY]
R67  2k  [RES 0402 IPC MID DENSITY]
R68  2k  [RES 0402 IPC MID DENSITY]
TP8  Testpoint  [TESTPOINT THT]  (value not drawn)  (no BOM)
TP9  Testpoint  [TESTPOINT THT]  (value not drawn)  (no BOM)
U1  LMK1C1103PWR  [8-TSSOP 0.65MM PITCH 4.4MM WIDTH IPC MID DENSITY]
U2  ADS124S08IPBSR  [32TQFP 7X7MM IPC LOW DENSITY]
U15  LT1991IMS#TRPBF  [10-SOP 0.5MM PITCH 3MM WIDTH IPC HIGH DENSITY]
U16  LT1991IMS#TRPBF  [10-SOP 0.5MM PITCH 3MM WIDTH IPC HIGH DENSITY]
U17  SN74LVC1G139DCTT  [DCT0008A_L]
Y1  SIT1602Bx  [4PQFN NON-IPC SITIME]

### Blocks framed on the sheet
Input Antialiasing Filters: C55-C58 R44 R51 R67 R68
A, C (entire region): C50 C51 R60-R64 U1 Y1

### Ports
ACF_OUT (in, see soldier_top[5B], soldier_Integrators[2B]), ACF_SW (out, see soldier_top[5B], soldier_TIA[6C]), ADC_CLK (bidir, see soldier_top[5C], soldier_BoardInterfaces[3C]), BRD_TMP (in, see soldier_top[5B], soldier_TIA[3D]), GAIN_SW (out, see soldier_top[5B], soldier_TIA[3A]), IVC_OUT (in, see soldier_top[5B], soldier_Integrators[4B]), IVC_SW (out, see soldier_top[5B], soldier_TIA[6C]), NEG_SW (out, see soldier_top[5B], soldier_Power[2A]), PD_TMP (in, see soldier_top[5B], soldier_TIA[3D]), SPI_MISO (out, see soldier_top[5C], soldier_BoardInterfaces[4B]), SPI_MOSI (in, see soldier_top[5C], soldier_BoardInterfaces[4A], soldier_TIA[1D]), SPI_SCLK (in, see soldier_top[5C], soldier_BoardInterfaces[4B], soldier_TIA[1D]), STRT (in, see soldier_top[5C]), TIA_OUT (in, see soldier_top[5B], soldier_TIA[5B]), TIA_SW (out, see soldier_top[5B], soldier_TIA[6B]), ~{DRDY} (out, see soldier_top[5C]), ~{RESET} (in, see soldier_top[5C]), ~{SPI_CS_ADC} (in, see soldier_top[5C], soldier_BoardInterfaces[4B])

### Nets
3V3: C47.2 C48.2 C50.2 C51.2 R60.2 R61.2 U1.6(VDD) U2.15(IOVDD) U2.16(DVDD) Y1.4(VDD)  [project net SYS_DVDD]
4V9: R68.1
10V: C37.2 C38.2 C41.2 C42.2 U15.7(VCC) U16.7(VCC)
-11V: C39.2 C40.2 C43.2 C44.2 U15.4(VEE) U16.4(VEE)
A2V5: U2.7(AIN0) U2.30(REFP0) U15.1(P1) U16.1(P1)
AVDD: C45.2 C46.2 C54.2 U2.26(AVDD) U17.8(VCC)
GND: C37.1 C38.1 C39.1 C40.1 C41.1 C42.1 C43.1 C44.1 C45.1 C46.1 C47.1 C48.1 C49.1 C50.1 C51.1 C54.1 C55.1 C56.1 C57.1 C58.1 J17.2 J18.2(GND) J18.3(GND) J18.4(GND) J18.5(GND) U1.4(GND) U2.1(AINCOM) U2.14(DGND) U2.24(REFCOM) U2.27(AVSS) U2.28(AVSS-SW) U2.29(REFN0) U15.5(REF) U16.5(REF) U17.4(GND) Y1.2(GND)  [project net SYS_GND]
ADC_CLK: R62.1 R65.2 ; port ADC_CLK
SPI_MISO: R58.2 ; port SPI_MISO
NetC30_2: J_TIA.1 R44.1 ; port TIA_OUT
NetC49_2: C49.2 TP9.1 U2.23(REFOUT)
NetC55_2: C55.2 R44.2 U2.2(AIN5)
NetC56_2: C56.2 R51.2 U2.3(AIN4)
NetC57_2: C57.2 R67.2 U2.4(AIN3)
NetC58_2: C58.2 R68.2 U2.5(AIN2)
NetJ8_1: U15.9(M3) ; port ACF_OUT
NetJ17_1: J17.1 J_ACF.2 J_IVC.2 J_TIA.2
NetJ18_1: J18.1(Signal) R64.1 R66.1
NetJ_ACF_1: J_ACF.1 R51.1 R56.2 U15.6(OUT)
NetJ_IVC_1: J_IVC.1 R57.2 R67.1 U16.6(OUT)
NetR1_2: U2.18(~{RESET}) ; port ~{RESET}
NetR3_2: R59.2 ; port ~{DRDY}
NetR5_2: U2.10(DIN) ; port SPI_MOSI
NetR6_2: U2.8(STR/SYNC) ; port STRT
NetR11_2: U2.11(SCLK) ; port SPI_SCLK
NetR12_2: U2.9(~{CS}) ; port ~{SPI_CS_ADC}
NetR19_2: U17.6(Y1) ; port TIA_SW
NetR36_2: U17.3(Y3) ; port IVC_SW
NetR38_2: U2.22(AIN8/GPIO0) ; port NEG_SW
NetR39_2: U17.5(Y2) ; port ACF_SW
NetR42_2: U2.19(AIN11/GPIO3) ; port GAIN_SW
NetR48_1: U2.31(AIN7/REFN1) ; port PD_TMP
NetR50_1: U2.32(AIN6/REFP1) ; port BRD_TMP
NetR56_1: R56.1 U15.8(M9)
NetR57_1: R57.1 U16.8(M9)
NetR58_1: R58.1 U2.12(DOUT/~{DRDY})
NetR59_1: R59.1 U2.13(~{DRDY})
NetR60_1: R60.1 Y1.1(OE)
NetR61_1: R61.1 U1.2(1G)
NetR62_2: R62.2 U1.3(Y0)
NetR63_1: R63.1 R65.1 R66.2 U2.17(CLK)
NetR63_2: R63.2 U1.8(Y1)
NetR64_2: R64.2 U1.5(Y2)
NetTP8_1: TP8.1 U2.6(AIN1)
NetU1_1: U1.1(CLKIN) Y1.3(OUT)
NetU2_20: U2.20(AIN10/GPIO2) U17.2(B)
NetU2_21: U2.21(AIN9/GPIO1) U17.1(A)
NetU14_10: U16.9(M3) ; port IVC_OUT

Not connected (* = marked no-connect by the designer): U1 7(NC)*; U2 25(NC)*; U15 2(P3)* 3(P9)* 10(M1)*; U16 2(P3)* 3(P9)* 10(M1)*; U17 7(Y0)*

### Notes on the sheet
- Decoder for IO expansion and to enforce mutual exclusivity on switches
- There was previously an RLC notch filter here because it was needed to filter the 14.2kHz switching noise from an AD6838 auto-zero amplifier, This was replaced by the OPA928 on the TIA sheet, which does not produce this noise.
- ADC can be configured to set A8 - A11 as GPIO. These are used to control the Bias and gain switches for the TIA channels.
- Float unused analog pins to reduce leakage current to other inputs.
- AVDD powers the PGA buffer. This requires a 5V rail for our spec to operate correctly. (Max 5.5V)
  When PGA is bypassed (i.e. in single-ended measurement) the aboslute voltage restrictions on the input are (AVSS - 0.15V) < VIN < (AVDD + 0.15V).
  Since the measurement is still a differential one, in order to have access to all possible byte codes (both positive and negative), a differential measurement should be made between the TIA input signal and 2.5V. Therefore when the TIA outputs 5V, the ADC measures a differential signal of 2.5V. And when the TIA outputs 0V (or close to), the ADC measures -2.5V.
- ADC can be configured to use any two inputs as the differential pair for signal measurement (including AINCOM).
- Antialiasing filter Calculation:
  Theoretical maximum over/underbias: +-5V
  Input current limit in conduction: 10mA -> 5 for safety
  1000 ohm minimum
  Datasheet reccomends single stage RC with cutoff ~10x ODR. Max ODR is 4k SPS, So cutoff freq is 40kHz.
  2Kohm/2nF filter provides 39.7kHz cutoff.
- -> Tie CS pin to DGND if CS is not used
  -> Tie the CLK pin to DGND if the internal oscillator is used
  -> Tie the START/SYNC pin to DGND to control conversions by commands
  -> Tie the RESET pin to IOVDD if the RESET pin is not used
  -> If the DRDY output is not used, leave the DRDY pin unconnected or tie the DRDY pin to IOVDD using a weak pullup resistor
- The integrator output varies from 4.9V (no charge) to nominally -10.1V (full scale). (It can go lower without saturating but this preserves the range from previous designs.) This design with the LT1991 has the transfer function
  Vo = 1.25V (1 + Rf/150k) - Vi (Rf/150k),
  where Rf = 450k || (50k+5.11k) = 45.08k.
  The transfer function can more aggressively approach the bounds of the ADC full-scale range by changing the additional resistor (no more than 6.25k) between pins 6 and 8 (OUT and M9).
- Doubles as input protection
- (near U2) Photocurrent - TIA
- (near U2) Photocurrent - ACF
- (near U2) Photocurrent - IVC
- (near TP8) 4.9V
- It seems very useful to be able to measure the nominal 4.9V line, since the all the front-end outputs depend on what exactly is on that line. Since the bias voltage cannot be easily measured, that frees up a channel to do so.
- Concerns with these:
  Capacitive loading on the amplifier outputs?
  - This shouldn't be an issue as the decently large R value should decouple the capacitance from the amp outputs
  Offset error?
  - Differential input impedance of this ADC is 1G, so the effective divider formed here only has a 2ppm offset which is already in the noise floor.
  In any case, if these are causing problems adjusting the values or bypassing is easy.
- Compatible SiT1602B oscillator variants:
  SiT1602B[C|I][T|-]2[1|2|3][33|XX|YY][E|S|N]4.096000
- The ADC clock can be on the Sergeant, Soldier, or Specialist boards, and exactly one is required across all three boards.
  To have the clock on the Sergeant board, DNP components labelled with A.
  To have the clock on the Soldier board, DNP components labelled with B.
  To have the clock on the Specialist board, DNP components labelled with C.
  In every case, populate every other component within the red border.
- ALTAIR Photodiode Acquisition Payload - Soldier
- (Based on UVic ORCASat design Rev A.6 by Evan Moore)
- DRAFT - NOT RELEASED
- Additional MMCX connector can be used for direct low-noise measurement of the TIA output or one of the integrator outputs.

### Library data of the parts
C37 C39 C41 C43 C45 C47 C50 C51 C54 = CAP: Kemet C0603C104K5RACAUTO - Cap Ceramic 0.1uF 50V X7R 10% 0603 125C Paper T/R; MF: Kemet; MP: C0603C104K5RACAUTO
C38 C40 C42 C44 C46 C48 C49 = CAP: Murata GRM21BR61E106KA73L - Cap Ceramic 10uF 10% 25V X5R 0805; MF: Murata; MP: GRM21BR61E106KA73L
C55-C58 = CAP: Cap, Nonpolar, Any, Must choose footprint manually
J17 = MMCX_recp: Conn MMCX F 50Ohm Solder ST SMD Gold Tray; Body Material: Brass; Connector Type: PCB,SMA,Coaxial; Impedance: 50R; Gender: Female; MF: Molex; MP: 0734152061; Dielectric Material: PTFE; Max Frequency: 6GHz; Voltage Rating: 170V; RoHS: Yes; Category: RF / Coaxial Connectors; Stock 1: 31911; Mount: Through Hole; Case/Package: SMA; Insulation Material: Teflon; Body Plating: Gold; Contact Material: Copper; Contact Plating: Gold; Plating: Gold; Termination: Solder; Packaging: Bulk; Package Quantity: 1600; Orientation: Straight; Length: 6.08mm; Depth: 6.08mm; Radiation Hardening: No; Lead Free: Lead Free; Halogen Free: Low Halogen; REACH SVHC: Unknown; ComponentLink1URL: https://datasheet.ciiva.com/30257/448910733910070-rf-coax-nectors-30257114.pdf?src-supplier=Onlinecomponents.com; ComponentLink1Description: https://datasheet.ciiva.com/30257/448910733910070-rf-coax-nectors-30257114.pdf?src-supplier=Onlinecomponents.com; ComponentLink2URL: https://datasheet.ciiva.com/5175/0733910070-rf-coax-connectors-173128-5175036.pdf?src-supplier=Mouser; ComponentLink2Description: https://datasheet.ciiva.com/5175/0733910070-rf-coax-connectors-173128-5175036.pdf?src-supplier=Mouser; ComponentLink3URL: https://datasheet.ciiva.com/15172/getdatasheetpartid-226633-15172901.pdf?src-supplier=Verical; ComponentLink3Description: https://datasheet.ciiva.com/15172/getdatasheetpartid-226633-15172901.pdf?src-supplier=Verical; ComponentLink4URL: https://datasheet.ciiva.com/9419/0733910070-rf-coax-connectors-9419351.pdf?src-supplier=Avnet; ComponentLink4Description: https://datasheet.ciiva.com/9419/0733910070-rf-coax-connectors-9419351.pdf?src-supplier=Avnet; ComponentLink5URL: https://datasheet.ciiva.com/16677/0733910070-rf-coax-connectors-16677276.pdf?src-supplier=Avnet+Europe; ComponentLink5Description: https://datasheet.ciiva.com/16677/0733910070-rf-coax-connectors-16677276.pdf?src-supplier=Avnet+Europe; Supplier 1: Digi-Key; Supplier Part Number 1: WM5560-ND; Manufacturer: Molex; Manufacturer Part Number: 0734152061; Pricing 1: 1=2.42000, 10=2.19800, 25=2.06320, 50=1.97360, 100=1.88390, 250=1.70448, 500=1.56992, 1000=1.34565, 2500=1.25594 (USD); Housing Color: Gold; Min Operating Temperature: -55°C; Max Operating Temperature: 165°C; Fastening Type: Snap; ComponentLink6URL: https://datasheet.ciiva.com/15237/133380734152061-rf-coax-nectors-15237680.pdf?src-supplier=Arrow+Europe; ComponentLink6Description: https://datasheet.ciiva.com/15237/133380734152061-rf-coax-nectors-15237680.pdf?src-supplier=Arrow+Europe; ComponentLink7URL: https://datasheet.ciiva.com/18494/734152061-sd-18494866.pdf?src-supplier=Digi-Key; ComponentLink7Description: https://datasheet.ciiva.com/18494/734152061-sd-18494866.pdf?src-supplier=Digi-Key; ComponentLink8URL: https://datasheet.ciiva.com/3951/128690734152061-rf-coax-nectors-3951867.pdf?src-supplier=Arrow+Electronics; ComponentLink8Description: https://datasheet.ciiva.com/3951/128690734152061-rf-coax-nectors-3951867.pdf?src-supplier=Arrow+Electronics
J18 = CMP-207975-000001-3: Rf Coaxial, Mmcx Jack, 50 Ohm, Pcb Rohs Compliant: Yes |Wurth Elektronik 66012002111503; Insulation Resistance: 1GΩ; Impedance: 50Ω; Insertion Loss (dB): 0.25dB; Number of Contacts: 1; Voltage Rating: 170V; Dielectric Material: PTFE; Min Operating Temperature: -55°C; Connector Type: MMCX; Height: 4.6mm; RoHS: Compliant; Insulation Material: PTFE; Max Operating Temperature: 155°C; Contact Material: Gold, Nickel; MF: Wurth Elektronik; MP: 66012002111503
J_ACF J_IVC J_TIA = BC020-02-A-0200-0300-L-G: 2x1 Header SMD; MF: GCT (GLOBAL CONNECTOR TECHNOLOGY); Datasheet Link: https://gct.co/connector/bc020; MP: BC020-02-A-0200-0300-L-G; Mouser Part Number: 640-BC02002A02300LG; Mouser Price/Stock: https://www.mouser.co.uk/ProductDetail/GCT/BC020-02-A-0200-0300-L-G?qs=KUoIvG%2F9IlakgsojlT9P9w%3D%3D
R44 R51 R67 R68 = RES: Res, Any, Manually select footprint
R56 R57 = RES: Panasonic ERA-2AEB5111X - Res 5.11k 0.1% 1/16W SMD 0402; MF: Panasonic Electronic Components; MP: ERA-2AEB5111X
R58 R59 = RES: Stackpole RMCF0402JT47R0 - Res 47Ohm 5% 0.063W 0402 Thick Film AEC-Q200 compliant; MF: Stackpole Electronics Inc.; MP: RMCF0402JT47R0
R60 R61 = RES: Vishay CRCW060310K0FKEA SMD 0603 10k, CRCW e3 Series, 75V, thick film, 100mW; MF: Vishay Dale; MP: CRCW060310K0FKEA
R62-R64 = RES: Yageo RC0402FR-0733RL - Res 33Ohm 1% 1/16W 0402; MF: YAGEO; MP: RC0402FR-0733RL
R65 R66 = RES: Yageo RC0402JR-070RL - Res 0 Ohms 1/16W SMD 0402; MF: YAGEO; MP: RC0402JR-070RL
U1 = LMK1C1103PWR: LVCMOS CLOCK BUFFER 3-CHANNEL; MF: Texas Instruments; MP: LMK1C1103PWR
U2 = ADS124S08IPBSR: 24BIT ADC Delta-Sigma 4k samples/s PGA V-reference; Interface: SPI; Number of Inputs: 12; Number of Bits: 24; Sampling Rate: 4000S/s; Number of A/D Converters: 1; MF: Texas Instruments; RoHS: No; Category: Analog to Digital Converters (ADCs); Stock 1: 2523; Mount: Surface Mount; Case/Package: LQFP; Number of Pins: 32; Min Operating Temperature: -50°C; Max Operating Temperature: 125°C; Packaging: Tape and Reel; ComponentLink1URL: http://www.ti.com/general/docs/lit/getliterature.tsp?genericPartNumber=ADS124S08&fileType=pdf&src-supplier=Farnell; ComponentLink1Description: http://www.ti.com/general/docs/lit/getliterature.tsp?genericPartNumber=ADS124S08&fileType=pdf&src-supplier=Farnell; ComponentLink2URL: http://www.ti.com/lit/ds/symlink/ads124s06.pdf?src-supplier=Digi-Key; ComponentLink2Description: http://www.ti.com/lit/ds/symlink/ads124s06.pdf?src-supplier=Digi-Key; Supplier 1: Digi-Key; Supplier Part Number 1: 296-45170-1-ND; MP: ADS124S08IPBSR
U15 U16 = LT1991IMS#TRPBF: Programmable Gain Amplifier - Single Channel, Precision, -13 to 14 Gain Selectable Operational Amplifier, 0.56 MHz Typical GBW, 0.12 V/us Typical SR, 2.4 to 40 V, 10-Pin SOP (MS-10), Industial, Pb-Free, Reel; Linear Technology Part Number: LT1991; MF: Linear Technology; Vos (mV) Guaranteed: 0.05; Channels (#): 1; Is (mA) Typical: 0.1; Vs Max (V): 40; Vos (mV) Typical: 0.015; Vs Min (V): 2.4; GBW (MHz) Typical: 0.56; SR (V/us) Typical: 0.12; ComponentLink1Description: Manufacturer URL; PackageVersion: Rev E; PackageDescription: 10-Lead Plastic MSOP, Body 3 x 3 mm, Pitch 0.5 mm; ComponentLink1URL: http://www.linear.com/; Mounting Technology: Surface Mount; MP: LT1991IMS#TRPBF; Type: SGA; RoHS: Pb-Free; ComponentLink3URL: http://cds.linear.com/docs/en/packaging/MSOP_10_05-08-1661.pdf; ComponentLink3Description: Package Specification; ComponentLink2Description: Datasheet; DatasheetVersion: Rev. H; ComponentLink2URL: http://cds.linear.com/docs/en/datasheet/1991fh.pdf; Packing: Reel; RevisionNote: URLs updated; PackageReference: LT-MS-10
U17 = CMP-0859-00546-3: 2-Line-to-4-Line Decoder, DCT0008A, SMALL T&R; Manufacturer: Texas Instruments; Input Type: CMOS/TTL; VCC(Max)(V): 5.5; Specialty Logic Family: Decoder/Encoder/Multiplexer; ICC @ Nom Voltage(Max)(mA): 0.01; Schmitt Trigger: No; Technology Family: LVC; Bits(#): 1; Output Drive (IOL/IOH)(Max)(mA): 32/-32; Output Type: CMOS; Rating: Catalog; Voltage(Nom)(V): 1.8,2.5,3.3,5; F @ Nom Voltage(Max)(Mhz): 150; VCC(Min)(V): 1.65; tpd @ Nom Voltage(Max)(ns): 16.5,7.5,4.9,3.6; Logic: True; DatasheetVersion: SCES602C; Sub-Family: Decoder/Encoder/Multiplexer; 3-State Output: No; PackageReference: DCT0008A; Generic Part Number: SN74LVC1G139; Operating Temperature Range(C): -40 to 85
Y1 = SIT1602Bx: MEMS OSC XO 4.096MHZ H/LVCMOS; Max Supply Current: 4.5mA; MF: SiTime; MP: SiT1602BC-21-XXN-4.096000; RoHS Compliant: Yes; Width: 0.098inch; Height: 0.032inch; Mount: Surface Mount; Series: SIT1602; Case/Package: SMD/SMT

## Nets that join several sheets
4V9: soldier_Power (6 pins), soldier_TIA (14 pins), soldier_Integrators (8 pins), soldier_ADC (R68.1)
10V: soldier_Power (15 pins), soldier_TIA (8 pins), soldier_Integrators (C33.2 C34.2 U14.14), soldier_ADC (6 pins)
-11V: soldier_Power (5 pins), soldier_Integrators (C35.2 C36.2 U14.9), soldier_ADC (6 pins)
A2V5: soldier_Power (C52.2 C53.1 TP10.1 U10.6), soldier_ADC (U2.7 U2.30 U15.1 U16.1)
A5VSW: soldier_Power (TP3.1 U5.6 U5.7), soldier_TIA (10 pins)
AVDD: soldier_Power (5 pins), soldier_TIA (5 pins), soldier_ADC (5 pins)
SYS_DVDD: soldier_BoardInterfaces (J2.05 J3.15 JP.3 R1.1), soldier_ADC (10 pins)
SYS_GND: soldier_BoardInterfaces (23 pins), soldier_Power (42 pins), soldier_TIA (23 pins), soldier_ADC (36 pins)
ADC_CLK: soldier_BoardInterfaces (J2.07 J3.13), soldier_ADC (R62.1 R65.2)
GUARD: soldier_TIA (7 pins), soldier_Integrators (J10.1 J11.1 J12.1 J13.1)
IVC_SW_1_Sol: soldier_BoardInterfaces (J1.4 J2.17 J3.03), soldier_TIA (U12.3)
IVC_SW_2_Sol: soldier_BoardInterfaces (J1.3 J2.19 J3.01), soldier_TIA (U12.2)
NetC30_2: soldier_TIA (C30.2 K6.3 R45.2 U13.6), soldier_ADC (J_TIA.1 R44.1)
NetJ8_1: soldier_Integrators (J8.1), soldier_ADC (U15.9)
NetJ9_1: soldier_TIA (K4.3), soldier_Integrators (J9.1)
NetK2_3: soldier_TIA (K2.3), soldier_Integrators (U14.2)
NetR1_2: soldier_BoardInterfaces (R1.2 R2.2), soldier_ADC (U2.18)
NetR3_2: soldier_BoardInterfaces (R3.2 R4.2), soldier_ADC (R59.2)
NetR5_2: soldier_BoardInterfaces (R5.2), soldier_TIA (U12.6), soldier_ADC (U2.10)
NetR6_2: soldier_BoardInterfaces (R6.2 R7.2 R8.1), soldier_ADC (U2.8)
NetR9_2: soldier_BoardInterfaces (R9.2 R10.2), soldier_TIA (U12.4)
NetR11_2: soldier_BoardInterfaces (R11.2), soldier_TIA (U12.5), soldier_ADC (U2.11)
NetR12_2: soldier_BoardInterfaces (R12.2 R13.2), soldier_ADC (U2.9)
NetR19_2: soldier_TIA (R19.2), soldier_ADC (U17.6)
NetR36_2: soldier_TIA (R36.2), soldier_ADC (U17.3)
NetR38_2: soldier_Power (R38.2 R69.2), soldier_ADC (U2.22)
NetR39_2: soldier_TIA (R39.2), soldier_ADC (U17.5)
NetR42_2: soldier_TIA (R42.2), soldier_ADC (U2.19)
NetR48_1: soldier_TIA (R48.1), soldier_ADC (U2.31)
NetR50_1: soldier_TIA (R50.1), soldier_ADC (U2.32)
NetU12_14: soldier_TIA (U12.14), soldier_Integrators (U14.11)
NetU12_15: soldier_TIA (U12.15), soldier_Integrators (U14.12)
NetU14_10: soldier_Integrators (U14.10), soldier_ADC (U16.9)
SPI_MISO: soldier_BoardInterfaces (J1.10 J2.09 J3.11), soldier_ADC (R58.2)
VBAT: soldier_BoardInterfaces (D4.1 F1.2), soldier_Power (5 pins)